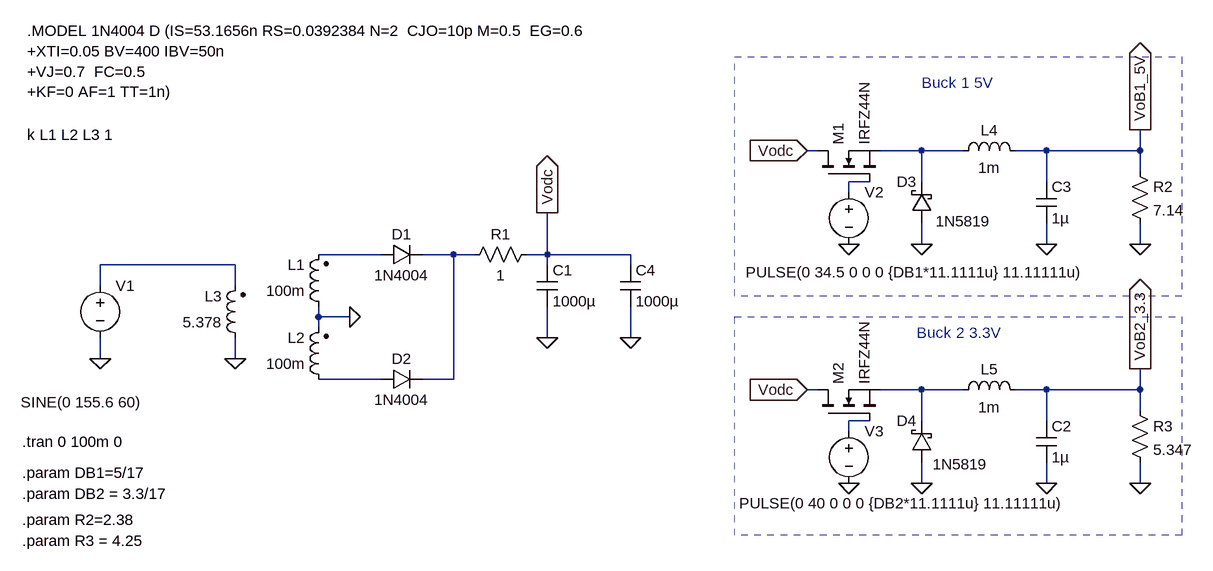
[diagram p0: schematic Power supply.asc]
Power supply.asc, the LTspice schematic file:
Version 4
SHEET 1 1308 680
WIRE 688 -288 672 -288
WIRE 848 -288 784 -288
WIRE 912 -288 848 -288
WIRE 1040 -288 992 -288
WIRE 1184 -288 1184 -320
WIRE 1184 -288 1040 -288
WIRE 1184 -256 1184 -288
WIRE 768 -240 736 -240
WIRE 848 -240 848 -288
WIRE 1040 -240 1040 -288
WIRE 736 -224 736 -240
WIRE 848 -144 848 -176
WIRE 1040 -144 1040 -176
WIRE 1184 -144 1184 -176
WIRE 16 -128 -80 -128
WIRE 128 -128 80 -128
WIRE 160 -128 128 -128
WIRE 272 -128 272 -192
WIRE 272 -128 240 -128
WIRE 400 -128 272 -128
WIRE -208 -112 -416 -112
WIRE 272 -112 272 -128
WIRE 400 -112 400 -128
WIRE -416 -80 -416 -112
WIRE -208 -80 -208 -112
WIRE -80 -32 -80 -48
WIRE -32 -32 -80 -32
WIRE -80 -16 -80 -32
WIRE 272 0 272 -48
WIRE 400 0 400 -48
WIRE -416 32 -416 0
WIRE -208 32 -208 0
WIRE 16 64 -80 64
WIRE 128 64 128 -128
WIRE 128 64 80 64
WIRE 688 80 672 80
WIRE 848 80 784 80
WIRE 912 80 848 80
WIRE 1040 80 992 80
WIRE 1184 80 1184 48
WIRE 1184 80 1040 80
WIRE 1184 112 1184 80
WIRE 768 128 736 128
WIRE 848 128 848 80
WIRE 1040 128 1040 80
WIRE 736 144 736 128
WIRE 848 224 848 192
WIRE 1040 224 1040 192
WIRE 1184 224 1184 192
FLAG -416 32 0
FLAG -208 32 0
FLAG -32 -32 0
FLAG 272 0 0
FLAG 848 224 0
FLAG 1040 224 0
FLAG 1184 224 0
FLAG 848 -144 0
FLAG 1040 -144 0
FLAG 1184 -144 0
FLAG 272 -192 Vodc
IOPIN 272 -192 Out
FLAG 672 -288 Vodc
IOPIN 672 -288 In
FLAG 672 80 Vodc
IOPIN 672 80 In
FLAG 736 -144 0
FLAG 736 224 0
FLAG 1184 -320 VoB1_5V
IOPIN 1184 -320 Out
FLAG 1184 48 VoB2_3.3
IOPIN 1184 48 Out
FLAG 400 0 0
SYMBOL ind2 -64 -32 R180
WINDOW 0 36 80 Left 2
WINDOW 3 36 40 Left 2
SYMATTR InstName L1
SYMATTR Value 100m
SYMBOL ind2 -64 80 R180
WINDOW 0 36 80 Left 2
WINDOW 3 36 40 Left 2
SYMATTR InstName L2
SYMATTR Value 100m
SYMBOL ind2 -192 16 R180
WINDOW 0 36 80 Left 2
WINDOW 3 36 40 Left 2
SYMATTR InstName L3
SYMATTR Value 5.378
SYMATTR SpiceLine Rser=1
SYMBOL voltage -416 -96 R0
WINDOW 3 -122 195 Left 2
WINDOW 123 0 0 Left 0
WINDOW 39 0 0 Left 0
SYMATTR Value SINE(0 155.6 60)
SYMATTR InstName V1
SYMBOL diode 16 -112 R270
WINDOW 0 32 32 VTop 2
WINDOW 3 0 32 VBottom 2
SYMATTR InstName D1
SYMATTR Value 1N4004
SYMBOL diode 16 80 R270
WINDOW 0 32 32 VTop 2
WINDOW 3 0 32 VBottom 2
SYMATTR InstName D2
SYMATTR Value 1N4004
SYMBOL cap 256 -112 R0
SYMATTR InstName C1
SYMATTR Value 1000µ
SYMBOL schottky 864 -176 R180
WINDOW 0 24 64 Left 2
WINDOW 3 -90 3 Left 2
SYMATTR InstName D3
SYMATTR Value 1N5819
SYMATTR Description Diode
SYMATTR Type diode
SYMBOL schottky 864 192 R180
WINDOW 0 24 64 Left 2
WINDOW 3 -86 -3 Left 2
SYMATTR InstName D4
SYMATTR Value 1N5819
SYMATTR Description Diode
SYMATTR Type diode
SYMBOL ind 896 -272 R270
WINDOW 0 32 56 VTop 2
WINDOW 3 5 56 VBottom 2
SYMATTR InstName L4
SYMATTR Value 1m
SYMBOL ind 896 96 R270
WINDOW 0 32 56 VTop 2
WINDOW 3 5 56 VBottom 2
SYMATTR InstName L5
SYMATTR Value 1m
SYMBOL cap 1024 128 R0
SYMATTR InstName C2
SYMATTR Value 1µ
SYMBOL cap 1024 -240 R0
SYMATTR InstName C3
SYMATTR Value 1µ
SYMBOL res 1168 -272 R0
SYMATTR InstName R2
SYMATTR Value 7.14
SYMBOL res 1168 96 R0
SYMATTR InstName R3
SYMATTR Value 5.347
SYMBOL nmos 688 -240 R270
SYMATTR InstName M1
SYMATTR Value IRFZ44N
SYMBOL nmos 688 128 R270
SYMATTR InstName M2
SYMATTR Value IRFZ44N
SYMBOL voltage 736 -240 R0
WINDOW 3 -159 139 Left 2
WINDOW 123 0 0 Left 0
WINDOW 39 0 0 Left 0
SYMATTR Value PULSE(0 34.5 0 0 0 {DB1*11.1111u} 11.11111u)
SYMATTR InstName V2
SYMBOL voltage 736 128 R0
WINDOW 3 -169 127 Left 2
WINDOW 123 0 0 Left 0
WINDOW 39 0 0 Left 0
SYMATTR Value PULSE(0 40 0 0 0 {DB2*11.1111u} 11.11111u)
SYMATTR InstName V3
SYMBOL cap 384 -112 R0
SYMATTR InstName C4
SYMATTR Value 1000µ
SYMBOL res 256 -144 R90
WINDOW 0 0 56 VBottom 2
WINDOW 3 32 56 VTop 2
SYMATTR InstName R1
SYMATTR Value 1
TEXT -528 -312 Left 2 !k L1 L2 L3 1
TEXT -536 160 Left 2 !.tran 0 100m 0
TEXT -536 208 Left 2 !.param DB1=5/17
TEXT -536 240 Left 2 !.param DB2 = 3.3/17
TEXT 848 -392 Left 2 ;Buck 1 5V
TEXT 840 -8 Left 2 ;Buck 2 3.3V
TEXT -536 280 Left 2 !.param R2=2.38
TEXT -536 312 Left 2 !.param R3 = 4.25
TEXT -528 -472 Left 2 !.MODEL 1N4004 D (IS=53.1656n RS=0.0392384 N=2  CJO=10p M=0.5  EG=0.6\n+XTI=0.05 BV=400 IBV=50n \n+VJ=0.7  FC=0.5 \n+KF=0 AF=1 TT=1n)
RECTANGLE Normal 1248 -64 560 -432 2
RECTANGLE Normal 1248 304 560 -32 2

The netlist it stands for:
* Power supply.asc
L1 0 N003 100m
L2 N006 0 100m
L3 0 N005 5.378 Rser=1
V1 N005 0 SINE(0 155.6 60)
D1 N003 N004 1N4004
D2 N006 N004 1N4004
C1 Vodc 0 1000µ
D3 0 N001 1N5819
D4 0 N007 1N5819
L4 N001 VoB1_5V 1m
L5 N007 VoB2_3.3 1m
C2 VoB2_3.3 0 1µ
C3 VoB1_5V 0 1µ
R2 VoB1_5V 0 7.14
R3 VoB2_3.3 0 5.347
M1 Vodc N002 N001 N001 IRFZ44N
M2 Vodc N008 N007 N007 IRFZ44N
V2 N002 0 PULSE(0 34.5 0 0 0 {DB1*11.1111u} 11.11111u)
V3 N008 0 PULSE(0 40 0 0 0 {DB2*11.1111u} 11.11111u)
C4 Vodc 0 1000µ
R1 Vodc N004 1
.model D D
.lib standard.dio
.model NMOS NMOS
.model PMOS PMOS
.lib standard.mos
k L1 L2 L3 1
.tran 0 100m 0
.param DB1=5/17
.param DB2 = 3.3/17
* Buck 1 5V
* Buck 2 3.3V
.param R2=2.38
.param R3 = 4.25
.MODEL 1N4004 D (IS=53.1656n RS=0.0392384 N=2  CJO=10p M=0.5  EG=0.6
+XTI=0.05 BV=400 IBV=50n
+VJ=0.7  FC=0.5
+KF=0 AF=1 TT=1n)
.backanno
.end